# EAGLE design board (EAGLE 9.6.2)
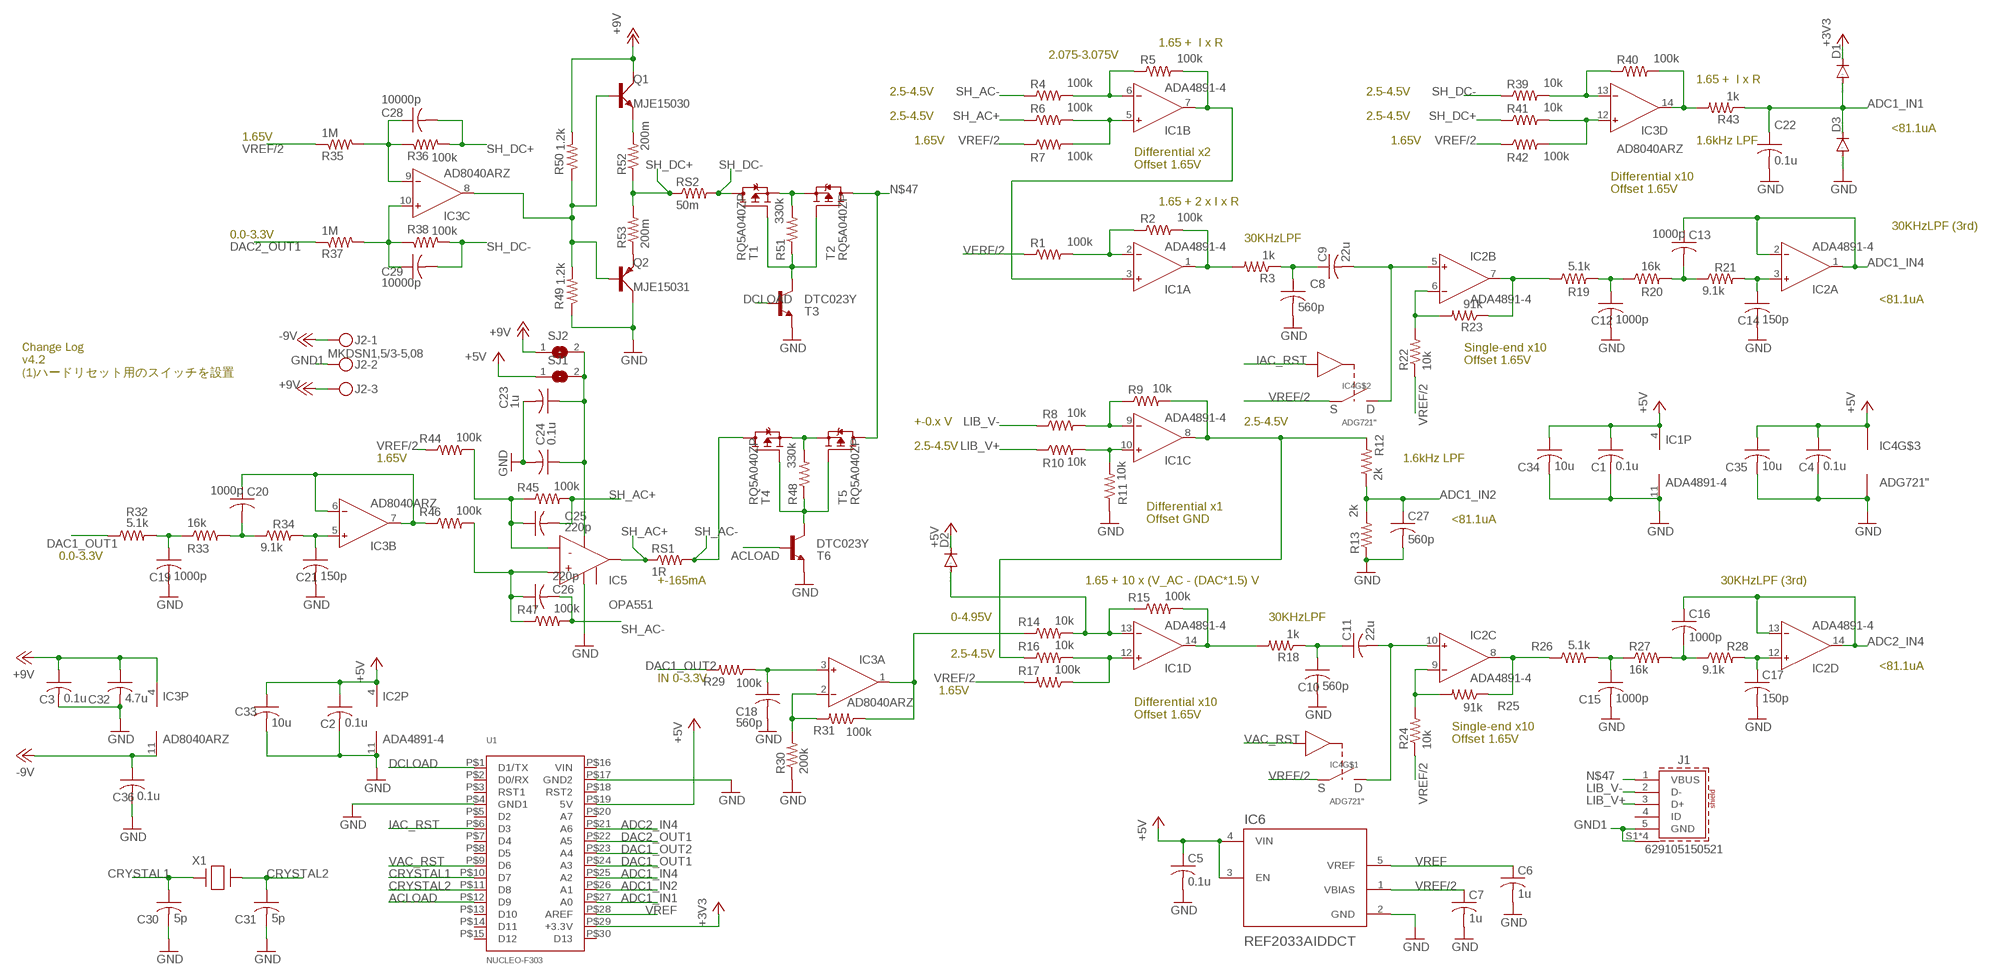
[diagram p0: schematic, sheet 1]

## Parts
C1  0.1u  C-USC0402K  [C0402K]
C2  0.1u  C-USC0402K  [C0402K]
C3  0.1u  C-USC0402K  [C0402K]
C4  0.1u  C-USC0402K  [C0402K]
C5  0.1u  C-USC0402K  [C0402K]
C6  1u  C-USC0402K  [C0402K]
C7  1u  C-USC0402K  [C0402K]
C8  560p  C-USC0402K  [C0402K]
C9  22u  C-USC0805  [C0805]
C10  560p  C-USC0402K  [C0402K]
C11  22u  C-USC0805  [C0805]
C12  1000p  C-USC0402K  [C0402K]
C13  1000p  C-USC0402K  [C0402K]
C14  150p  C-USC0402K  [C0402K]
C15  1000p  C-USC0402K  [C0402K]
C16  1000p  C-USC0402K  [C0402K]
C17  150p  C-USC0402K  [C0402K]
C18  560p  C-USC0402K  [C0402K]
C19  1000p  C-USC0402K  [C0402K]
C20  1000p  C-USC0402K  [C0402K]
C21  150p  C-USC0402K  [C0402K]
C22  0.1u  C-USC0402K  [C0402K]
C23  1u  C-USC0402K  [C0402K]
C24  0.1u  C-USC0402K  [C0402K]
C25  220p  C-USC0402K  [C0402K]
C26  220p  C-USC0402K  [C0402K]
C27  560p  C-USC0402K  [C0402K]
C28  10000p  C-USC0402K  [C0402K]
C29  10000p  C-USC0402K  [C0402K]
C30  5p  C-USC0402K  [C0402K]
C31  5p  C-USC0402K  [C0402K]
C32  4.7u  C-USC0402K  [C0402K]
C33  10u  C-USC0402K  [C0402K]
C34  10u  C-USC0402K  [C0402K]
C35  10u  C-USC0402K  [C0402K]
C36  0.1u  C-USC0402K  [C0402K]
D1  DIODE-SOD123  [SOD123]
D2  DIODE-SOD123  [SOD123]
D3  DIODE-SOD123  [SOD123]
IC1  ADA4891-4  AD8609R  [SO14]
IC2  ADA4891-4  AD8609R  [SO14]
IC3  AD8040ARZ  AD8609R  [SO14]
IC4  ADG721"  [MSOP8]
IC5  OPA551  [TO127P1435X464-8N]
IC6  REF2033AIDDCT  [SOT95P280X110-5N]
J1  629105150521  [629105150521]
J2  MKDSN1,5/3-5,08  [MKDSN1,5/3-5,08]
Q1  MJE15030  TIP41C  [TO220AV]
Q2  MJE15031  TIP42C  [TO220AV]
R1  100k  R-US_R0402  [R0402]
R2  100k  R-US_R0402  [R0402]
R3  1k  R-US_R0402  [R0402]
R4  100k  R-US_R0402  [R0402]
R5  100k  R-US_R0402  [R0402]
R6  100k  R-US_R0402  [R0402]
R7  100k  R-US_R0402  [R0402]
R8  10k  R-US_R0402  [R0402]
R9  10k  R-US_R0402  [R0402]
R10  10k  R-US_R0402  [R0402]
R11  10k  R-US_R0402  [R0402]
R12  2k  R-US_R0402  [R0402]
R13  2k  R-US_R0402  [R0402]
R14  10k  R-US_R0402  [R0402]
R15  100k  R-US_R0402  [R0402]
R16  10k  R-US_R0402  [R0402]
R17  100k  R-US_R0402  [R0402]
R18  1k  R-US_R0402  [R0402]
R19  5.1k  R-US_R0402  [R0402]
R20  16k  R-US_R0402  [R0402]
R21  9.1k  R-US_R0402  [R0402]
R22  10k  R-US_R0402  [R0402]
R23  91k  R-US_R0402  [R0402]
R24  10k  R-US_R0402  [R0402]
R25  91k  R-US_R0402  [R0402]
R26  5.1k  R-US_R0402  [R0402]
R27  16k  R-US_R0402  [R0402]
R28  9.1k  R-US_R0402  [R0402]
R29  100k  R-US_R0402  [R0402]
R30  200k  R-US_R0402  [R0402]
R31  100k  R-US_R0402  [R0402]
R32  5.1k  R-US_R0402  [R0402]
R33  16k  R-US_R0402  [R0402]
R34  9.1k  R-US_R0402  [R0402]
R35  1M  R-US_R0402  [R0402]
R36  100k  R-US_R0402  [R0402]
R37  1M  R-US_R0402  [R0402]
R38  100k  R-US_R0402  [R0402]
R39  10k  R-US_R0402  [R0402]
R40  100k  R-US_R0402  [R0402]
R41  10k  R-US_R0402  [R0402]
R42  100k  R-US_R0402  [R0402]
R43  1k  R-US_R0402  [R0402]
R44  100k  R-US_R0402  [R0402]
R45  100k  R-US_R0402  [R0402]
R46  100k  R-US_R0402  [R0402]
R47  100k  R-US_R0402  [R0402]
R48  330k  R-US_R0402  [R0402]
R49  1.2k  R-US_R0402  [R0402]
R50  1.2k  R-US_R0402  [R0402]
R51  330k  R-US_R0402  [R0402]
R52  200m  R-US_R2512  [R2512]
R53  200m  R-US_R2512  [R2512]
RS1  1R  R-US_R2512  [R2512]
RS2  50m  R-US_R2512  [R2512]
SJ1  SJ  [SJ]
SJ2  SJ  [SJ]
T1  RQ5A040ZP  [SOT23]
T2  RQ5A040ZP  [SOT23]
T3  DTC023Y  [SOT40P120X55-3N]
T4  RQ5A040ZP  [SOT23]
T5  RQ5A040ZP  [SOT23]
T6  DTC023Y  [SOT40P120X55-3N]
U1  NUCLEO-F303  [NUCLEO-F303]
X1  NX3225GD-8MHZ-STD-CRA-3XTAL_NX3225GD-8MHZ-STD-CRA-3_N  [XTAL_NX3225GD-8MHZ-STD-CRA-3_N]

## Nets
+3V3: D1.C U1.P$29(+3.3V)
+5V: C1.1 C2.1 C4.1 C5.1 C33.1 C34.1 C35.1 D2.C IC1.4(P:V+) IC2.4(P:V+) IC4.8(VDD) IC6.3(EN) IC6.4(VIN) SJ1.1 U1.P$19(5V)
+9V: J2.3 Q1.C R50.2 SJ2.1 ; supply symbol labelled -9V
-9V: C36.1 IC3.11(P:V-) J2.1 ; supply symbol labelled +9V
ACLOAD: T6.1(B) U1.P$12(D9)
ADC1_IN1: C22.1 D1.A D3.C R43.1 U1.P$27(A0)
ADC1_IN2: C27.1 R12.1 R13.2 U1.P$26(A1)
ADC1_IN3: IC3.1(A:OUT) R14.1 R31.1
ADC1_IN4: C13.1 IC2.1(A:OUT) IC2.2(A:IN-) U1.P$25(A2)
ADC2_IN4: C16.1 IC2.13(D:IN-) IC2.14(D:OUT) U1.P$21(A6)
CRYSTAL1: C30.1 U1.P$10(D7) X1.2
CRYSTAL2: C31.1 U1.P$11(D8) X1.1
DAC1_OUT1: R32.1 U1.P$24(A3)
DAC1_OUT2: R29.2 U1.P$23(A4)
DAC2_OUT1: R37.1 U1.P$22(A5)
DCLOAD: T3.1(B) U1.P$1(D1/TX)
GND1: C1.2 C2.2 C3.2 C4.2 C5.2 C6.2 C7.2 C8.2 C10.2 C12.2 C14.2 C15.2 C17.2 C18.2 C19.2 C21.2 C22.2 C23.2 C24.2 C27.2 C30.2 C31.2 C32.2 C33.2 C34.2 C35.2 C36.2 D3.A IC1.11(P:V-) IC2.11(P:V-) IC4.4(GND) IC5.4(V-) IC5.8(V-) IC6.2(GND) J1.5(GND) J1.S1(SHIELD) J1.S2(SHIELD) J1.S3(SHIELD) J1.S4(SHIELD) J2.2 Q2.C R11.1 R13.1 R30.1 R49.1 T3.2(E) T6.2(E) U1.P$4(GND1) U1.P$17(GND2) ; supply symbol labelled GND
IAC_RST: IC4.3(IN) U1.P$6(D3)
LIB_V+: J1.3(D+) R10.1
LIB_V-: J1.2(D-) R8.1
N$1: IC3.8(C:OUT) Q1.B Q2.B R49.2 R50.1
N$2: C16.2 R27.2 R28.1
N$3: IC1.9(C:IN-) R8.2 R9.1
N$4: C9.2 IC2.5(B:IN+) IC4.6(D)
N$5: IC1.14(D:OUT) R15.2 R18.2
N$6: C17.1 IC2.12(D:IN+) R28.2
N$7: C15.1 R26.2 R27.1
N$8: IC2.8(C:OUT) R25.1 R26.1
N$9: IC2.9(C:IN-) R24.2 R25.2
N$10: C11.2 IC2.10(C:IN+) IC4.2(D)
N$11: IC1.12(D:IN+) R16.2 R17.1
N$12: D2.A IC1.13(D:IN-) R14.2 R15.1
N$13: IC3.13(D:IN-) R39.2 R40.1
N$14: IC3.12(D:IN+) R41.2 R42.2
N$15: IC1.10(C:IN+) R10.2 R11.2
N$16: IC1.6(B:IN-) R4.2 R5.1
N$17: IC1.5(B:IN+) R6.2 R7.2
N$18: C13.2 R20.2 R21.1
N$19: IC3.2(A:IN-) R30.2 R31.2
N$20: C14.1 IC2.3(A:IN+) R21.2
N$21: C12.1 R19.2 R20.1
N$22: IC2.6(B:IN-) R22.2 R23.2
N$23: IC2.7(B:OUT) R19.1 R23.1
N$24: Q2.E R53.1
N$25: IC1.3(A:IN+) IC1.7(B:OUT) R5.2
N$26: R51.2 T1.2(S) T2.2(S)
N$27: IC3.14(D:OUT) R40.2 R43.2
N$28: C26.1 IC5.1(+IN) R46.2 R47.1
N$29: C18.1 IC3.3(A:IN+) R29.1
N$30: C20.2 R33.2 R34.1
N$31: C20.1 IC3.6(B:IN-) IC3.7(B:OUT) R46.1
N$32: C21.1 IC3.5(B:IN+) R34.2
N$33: C19.1 R32.2 R33.1
N$34: R51.1 T1.1(G) T2.1(G) T3.3(C)
N$35: IC1.2(A:IN-) R1.2 R2.1
N$36: C3.1 C23.1 C24.1 C32.1 IC3.4(P:V+) IC5.5(V+) SJ1.2 SJ2.2 ; supply symbol labelled +9V
N$39: C29.1 IC3.10(C:IN+) R37.2 R38.1
N$40: C28.1 IC3.9(C:IN-) R35.2 R36.1
N$41: Q1.E R52.2
N$42: R48.2 T4.2(S) T5.2(S)
N$43: IC1.1(A:OUT) R2.2 R3.2
N$44: C8.1 C9.1 R3.1
N$45: C10.1 C11.1 R18.1
N$46: R48.1 T4.1(G) T5.1(G) T6.3(C)
N$47: J1.1(VBUS) T2.3(D) T5.3(D)
N$49: IC1.8(C:OUT) R9.2 R12.2 R16.1
N$60: C25.1 IC5.2(-IN) R44.2 R45.1
SH_AC+: C25.2 IC5.6(OUT) R6.1 R45.2 RS1.1
SH_AC-: C26.2 R4.1 R47.2 RS1.2 T4.3(D)
SH_DC+: C28.2 R36.2 R41.1 R52.1 R53.2 RS2.1
SH_DC-: C29.2 R38.2 R39.1 RS2.2 T1.3(D)
VAC_RST: IC4.7(IN) U1.P$9(D6)
VERF/2: R1.1
VREF: C6.1 IC6.5(VREF) U1.P$28(AREF)
VREF/2: C7.1 IC4.1(S) IC4.5(S) IC6.1(VBIAS) R7.1 R17.2 R22.1 R24.1 R35.1 R42.1 R44.1
Unconnected: IC5.7(FLAG) J1.4(ID) U1.P$2(D0/RX) U1.P$3(RST1) U1.P$5(D2) U1.P$7(D4) U1.P$8(D5) U1.P$13(D10) U1.P$14(D11) U1.P$15(D12) U1.P$18(RST2) U1.P$20(A7) U1.P$30(D13)

## Notes on the sheet
- 1.65 +  I x R
- 2.075-3.075V
- 1.65 +  I x R
- 2.5-4.5V | 2.5-4.5V
- 2.5-4.5V | 2.5-4.5V
- 1.65V | <81.1uA
- 1.65V | 1.65V | 1.6kHz LPF
- Differential x2
  Offset 1.65V
- Differential x10
  Offset 1.65V
- 1.65 + 2 x I x R
- 0.0-3.3V | 30KHzLPF (3rd)
- 30KHzLPF
- <81.1uA
- Single-end x10
  Offset 1.65V
- Change Log
  v4.2
  (1)ハードリセット用のスイッチを設置
- +-0.x V | 2.5-4.5V
- 2.5-4.5V
- 1.65V | 1.6kHz LPF
- Differential x1
  Offset GND
- <81.1uA
- 0.0-3.3V
- +-165mA | 1.65 + 10 x (V_AC - (DAC*1.5) V | 30KHzLPF (3rd)
- 0-4.95V | 30KHzLPF
- 2.5-4.5V
- <81.1uA
- IN 0-3.3V
- 1.65V
- Differential x10
  Offset 1.65V
- Single-end x10
  Offset 1.65V

## Power pins joined to a net without a drawn wire
VIN: U1.P$16(VIN)

## Library data of the parts
C1-C5 C22 C24 C30-C36 = rcl:C-US: CAPACITOR, American symbol; #: GRM155B31C104K; SPICEPREFIX: C
C6-C21 C23 C25-C29 = rcl:C-US: CAPACITOR, American symbol; SPICEPREFIX: C
D1-D3 = diode:DIODE-: DIODE
IC1-IC3 = analog-devices:AD8609: Precision Micropower, Low Noise CMOS, Rail-to-Rail Input/Output Operational Amplifiers Source: http://www.analog.com/static/imported-files/data_sheets/AD8603_8607_8609.pdf; MPN: AD8609ARZ; OC_FARNELL: 1581951; OC_NEWARK: 19M0976
IC4 = ADG721:ADG721
IC5 = OPA551:OPA551
IC6 = REF2033AIDDCT:REF2033AIDDCT: 3.3-V Vref, low-drift, low-power, dual-output Vref & Vref/2 voltage reference 5-SOT-23-THIN -40 to 125 Check prices <https://pricing.snapeda.com/parts/REF2033AIDDCT/Texas%20Instruments/view-part?ref=eda>; AVAILABILITY: In Stock; DESCRIPTION: 3.3-V Vref, low-drift, low-power, dual-output Vref & Vref/2 voltage reference 5-SOT-23-THIN -40 to 125; MF: Texas Instruments; MP: REF2033AIDDCT; PACKAGE: SOT-23-THN-5 Texas Instruments; PRICE: None; PURCHASE-URL: https://pricing.snapeda.com/search/part/REF2033AIDDCT/?ref=eda
J1 = Wurth_Connectors_WR-USB-DrillSize-Modified:629105150521: WR-COM Micro USB 2.0 SMT Type B Horizontal 5 Contacts High Current Kind Properties Durability:10 000 Mating cycles Quality Class:10 000 Mating cycles Connector Type:Micro USB Gender:Receptacle Type:Horizontal General Information Operating Temperature:-40up to +105 °C Compliance:RoHS Electrical Properties IR 1:3A Working Voltage:30V (AC) Withstanding Voltage:100V (AC) Contact Resistance:30 mΩ Material Properties Insulator Material:LCP Insulator Flammability Rating:UL94 V-0 Color:Black Contact Material:Copper Alloy Contact Plating: Gold Contact Type:Stamped Shielding Material:Stainless Steel Shielding Plating:Nickel <https://www.we-online.com/catalog/media/o86333v209%20WR-COM_629105150521_family.jpg> Details see: www.we-online.com/en/components/products/COM_MICRO_SMT_TYPE_B_HORIZONTAL_HIGH_CURRENT <www.we-online.com/catalog/COM_MICRO_SMT_TYPE_B_HORIZONTAL_HIGH_CURRENT/?utm_source=eagle_model&utm_medium=description_link&utm_campaign=eisos_eagle> Updated by Ella Wu 2023-05-30 2023 (C) Würth Elektronik; APPLICATION: Micro USB 2.0; DATASHEET-URL: https://www.we-online.com/redexpert/spec/629105150521?ae; GERDER: Receptacle; INTERFACE-TYPE: Type B; IR: 3.0A; MOUNT: SMT; PACKAGING: Tape and Reel; PART-NUMBER: 629105150521; PINS: 5; TYPE: Horizontal; WORKING-VOLTAGE: 30V(AC)
J2 = con-phoenix-508:MKDSN1,5/3-5,08: MKDSN 1,5/ 3-5,08 Printklemme Nennstrom: 13,5 A Nennspannung: 250 V Rastermaß: 5,08 mm Polzahl: 3 Anschlussart: Schraubanschluss Montage: Löten Anschlussrichtung Leiter/Platine: 0 ° Artikelnummer: 1729131 Source: http://eshop.phoenixcontact.com .. 1729131.pdf
Q1 = transistor-power:TIP41C: NPN TRANSISTOR
Q2 = transistor-power:TIP42C: PNP TRANSISTOR
R1-R53 RS1 RS2 = rcl:R-US_: RESISTOR, American symbol; SPICEPREFIX: R
SJ1 SJ2 = jumper:SJ: SMD solder JUMPER
T1 T2 T4 T5 = RQ5A040ZP:RQ5A040ZP
T3 T6 = DTC023Y:DTC023Y
U1 = nucleo-F303:NUCLEO-F303
X1 = NX3255GD:NX3225GD-8MHZ-STD-CRA-3; COPYRIGHT: Copyright (C) 2022 Ultra Librarian. All rights reserved.; MANUFACTURER_PART_NUMBER: NX3225GD-8MHZ-STD-CRA-3; MFR_NAME: NDK

## Board
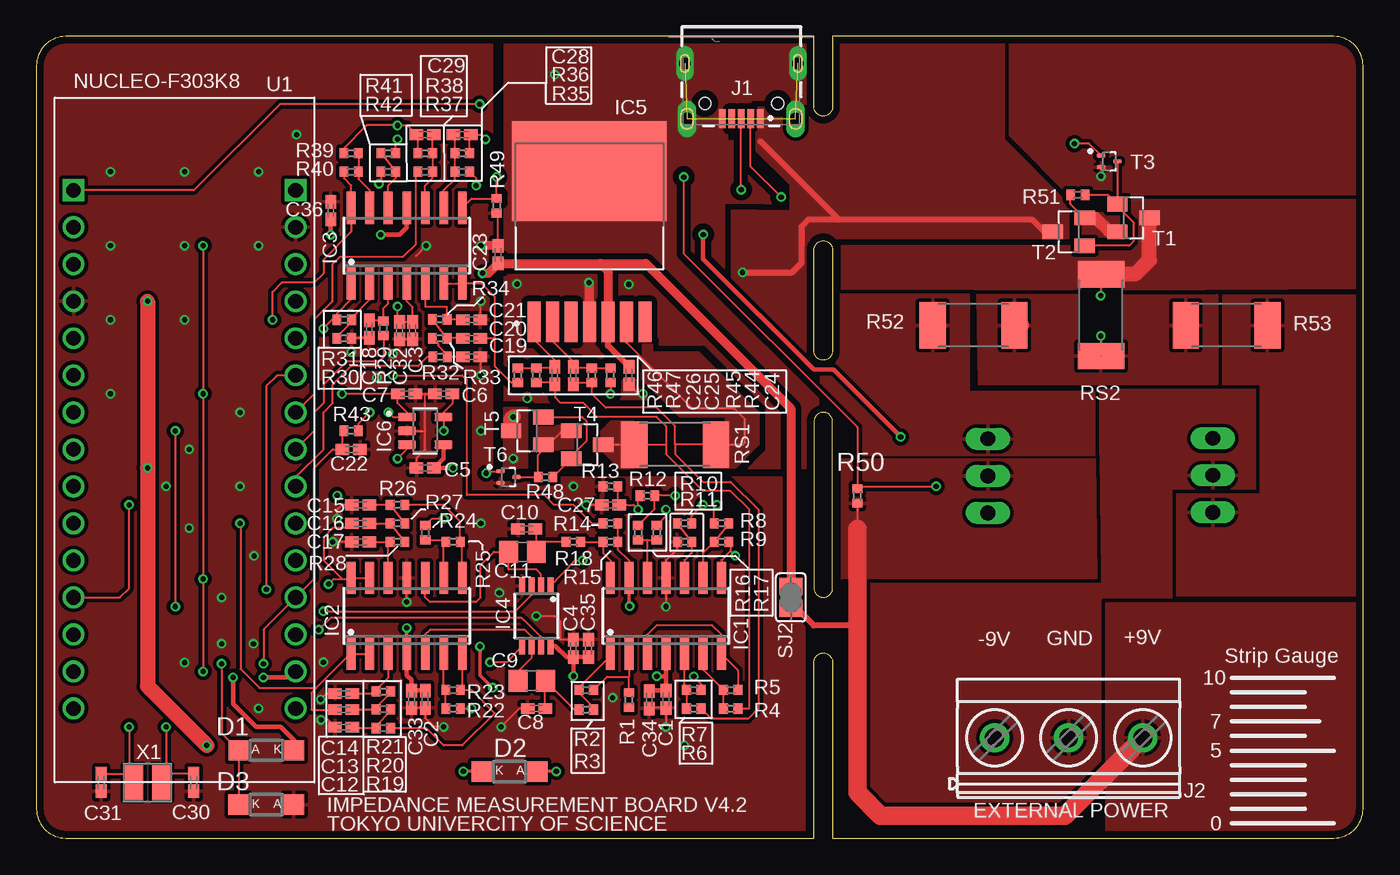
[diagram p1: board, top side]
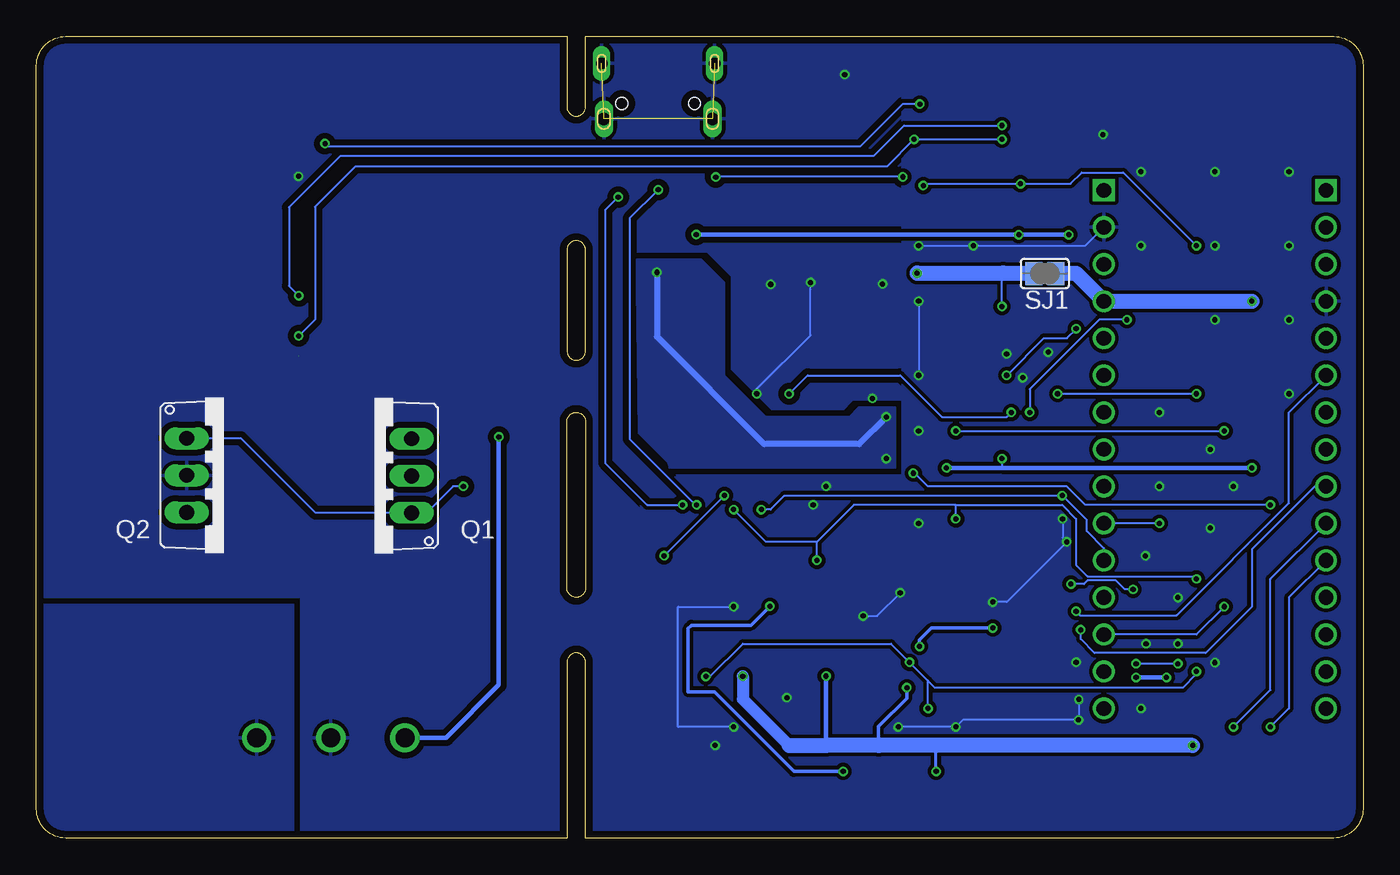
[diagram p2: board, bottom side, seen from below]

Size 91 x 55 mm. Coordinates in mm from the lower left corner, seen from the top.
Outline: 0,53 0,2 arc90 2,0 53.34,0 53.34,12.06 arc-90 53.98,12.7 arc-90 54.61,12.06 54.61,0 89,0 arc90 91,2 91,53 arc90 89,55 54.61,55 54.61,50.16 arc-90 53.98,49.53 arc-90 53.34,50.16 53.34,55 2,55 arc90 0,53
Outline: 53.98,16.51 arc90 54.61,17.14 54.61,28.57 arc90 53.98,29.21 arc90 53.34,28.57 53.34,17.14 arc90 53.98,16.51
Outline: 54.61,40.35 54.61,33.42 arc-90 53.94,32.78 arc-90 53.34,33.42 53.34,40.35 arc-90 53.94,40.98 arc-90 54.61,40.35
Copper layers (1*16): Top 0.035mm / dielectric 1.53mm / Bottom 0.035mm
Design rules "pban_5mil-l2": minimum track width 5mil, minimum drill 0.3mm, track to track 5mil, track to pad 0.229mm, pad to pad 5mil, via to via 5mil, smd to smd 5mil, copper to edge 0.5mm, drill to drill 0.5mm, minimum pad ring 0.15mm, minimum via ring 0.15mm, stop-mask expansion 4mil, vias tented up to drill 0.35mm, thermal gap 10mil

### Footprints (pad centres in the part's own frame; a part is rotated, then mirrored left to right if it is on the bottom)
C0402K = smd 0.925 x 0.74: 1 -0.6,0; 2 0.6,0
C0805 = smd 1.3 x 1.5: 1 -0.95,0; 2 0.95,0
SOD123 = smd 1.4 x 1.4: A 1.9,0; C -1.9,0
SO14 = smd 0.6 x 2.2: 1 -3.81,-2.6; 2 -2.54,-2.6; 3 -1.27,-2.6; 4 0,-2.6; 5 1.27,-2.6; 6 2.54,-2.6; 7 3.81,-2.6; 8 3.81,2.6; 9 2.54,2.6; 10 1.27,2.6; 11 0,2.6; 12 -1.27,2.6; 13 -2.54,2.6; 14 -3.81,2.6
MSOP8 = smd 0.4 x 1.2: 1 -0.975,-2.05; 2 -0.325,-2.05; 3 0.325,-2.05; 4 0.975,-2.05; 5 0.975,2.05; 6 0.325,2.05; 7 -0.325,2.05; 8 -0.975,2.05
TO127P1435X464-8N = smd 0.89 x 2.79: 1 -3.81,-6.19; 2 -2.54,-6.19; 3 -1.27,-6.19; 4 0,-6.19; 5 1.27,-6.19; 6 2.54,-6.19; 7 3.81,-6.19 | smd 10.58 x 6.84: 8 0,4.16
SOT95P280X110-5N = smd 1.25 x 0.59: 1 -1.255,0.95; 2 -1.255,0; 3 -1.255,-0.95; 4 1.255,-0.95; 5 1.255,0.95
629105150521 = smd 0.45 x 1.3: 1 -1.3,2.9; 2 -0.65,2.9; 3 0,2.9; 4 0.65,2.9; 5 1.3,2.9 | drill 0.85 pad 1 long: S1 -3.725,2.9; S2 3.725,2.9 | drill 0.8 pad 0.9 long: S3 3.875,-0.9; S4 -3.875,-0.9 | hole 0.8: -2.5,1.85; 2.5,1.85
MKDSN1,5/3-5,08 = drill 1.3 pad 2: 1 -7.641,0.025; 2 -2.561,0.025; 3 2.519,0.025
TO220AV = drill 1.016 long: B -2.54,-2.54; C 0,-2.54; E 2.54,-2.54
R0402 = smd 0.6 x 0.7: 1 -0.5,0; 2 0.5,0
R2512 = smd 1.8 x 3.2: 1 -2.8,0; 2 2.8,0
SJ = smd 1.168 x 1.6: 1 -0.762,0; 2 0.762,0
SOT23 = smd 1 x 1.4: 1 -0.95,-1.1; 2 0.95,-1.1; 3 0,1.1
SOT40P120X55-3N = smd 0.59 x 0.25: 1 -0.555,0.4; 2 -0.555,-0.4; 3 0.555,0
NUCLEO-F303 = drill 1 square: P$1 -7.62,17.78; P$16 7.62,17.78 | drill 1: P$2 -7.62,15.24; P$3 -7.62,12.7; P$4 -7.62,10.16; P$5 -7.62,7.62; P$6 -7.62,5.08; P$7 -7.62,2.54; P$8 -7.62,0; P$9 -7.62,-2.54; P$10 -7.62,-5.08; P$11 -7.62,-7.62; P$12 -7.62,-10.16; P$13 -7.62,-12.7; P$14 -7.62,-15.24; P$15 -7.62,-17.78; P$17 7.62,15.24; P$18 7.62,12.7; P$19 7.62,10.16; P$20 7.62,7.62; P$21 7.62,5.08; P$22 7.62,2.54; P$23 7.62,0; P$24 7.62,-2.54; P$25 7.62,-5.08; P$26 7.62,-7.62; P$27 7.62,-10.16; P$28 7.62,-12.7; P$29 7.62,-15.24; P$30 7.62,-17.78
XTAL_NX3225GD-8MHZ-STD-CRA-3_N = smd 1.295 x 2.388: 1 -0.953,0; 2 0.953,0

### Placement (x,y rotation side)
C1  43.18,9.53 270 top
C2  26.67,9.53 270 top
C3  25.81,34.82 270 top
C4  36.83,13.02 90 top
C5  26.67,25.4 180 top
C6  27.94,30.48 180 top
C7  25.4,30.48 0 top
C8  34.29,8.89 180 top
C9  33.97,10.79 180 top
C10  33.63,21.21 180 top
C11  33.34,19.64 180 top
C12  21.08,7.62 180 top
C13  21.08,8.81 0 top
C14  21.08,9.91 180 top
C15  22.23,22.86 180 top
C16  22.23,21.59 0 top
C17  22.23,20.32 180 top
C18  22.83,34.92 270 top
C19  29.84,33.02 0 top
C20  29.84,34.29 180 top
C21  29.84,35.56 0 top
C22  21.59,26.67 0 top
C23  31.67,40.03 90 top
C24  40.64,31.75 270 top
C25  36.83,31.75 270 top
C26  35.56,31.75 270 top
C27  39.37,22.86 180 top
C28  29.21,48.26 0 top
C29  26.67,48.26 180 top
C30  10.79,3.81 270 top
C31  4.45,3.81 270 top
C32  24.92,34.82 270 top
C33  25.73,9.53 270 top
C34  42.04,9.5 270 top
C35  37.87,13.03 90 top
C36  20.19,43.05 90 top
D1  15.77,6.02 180 top
D2  32.46,4.57 0 top
D3  15.75,2.29 0 top
IC1  43.18,15.24 0 top
IC2  25.4,15.24 0 top
IC3  25.4,40.64 0 top
IC4  34.29,15.24 180 top
IC5  37.93,41.6 0 top
IC6  26.67,27.94 0 top
J1  48.35,52.25 180 top
J2  73.37,6.86 0 top
Q1  67.8,24.85 90 bottom
Q2  78.15,24.89 270 bottom
R1  40.64,9.47 90 top
R2  37.72,10.16 180 top
R3  37.72,8.81 0 top
R4  47.62,8.89 180 top
R5  47.62,10.16 0 top
R6  45.09,8.89 180 top
R7  45.09,10.16 180 top
R8  46.99,21.59 0 top
R9  46.99,20.32 0 top
R10  44.45,21.59 180 top
R11  44.45,20.32 0 top
R12  41.91,23.5 0 top
R13  39.37,24.13 0 top
R14  39.37,21.59 0 top
R15  39.37,20.32 180 top
R16  41.27,20.95 270 top
R17  42.55,20.95 90 top
R18  36.83,20.32 0 top
R19  23.8,7.54 180 top
R20  23.8,8.84 180 top
R21  23.8,10.06 180 top
R22  28.57,8.89 180 top
R23  28.57,10.16 180 top
R24  26.67,20.95 270 top
R25  28.57,20.32 180 top
R26  24.77,22.86 180 top
R27  24.77,21.59 180 top
R28  24.77,20.32 180 top
R29  23.8,34.98 270 top
R30  21.11,34.29 180 top
R31  21.11,35.56 0 top
R32  27.69,33.02 0 top
R33  27.66,34.29 0 top
R34  27.66,35.59 0 top
R35  29.21,45.72 180 top
R36  29.21,46.99 0 top
R37  26.67,45.72 0 top
R38  26.67,46.99 180 top
R39  21.59,46.99 0 top
R40  21.59,45.72 180 top
R41  24.13,46.99 180 top
R42  24.13,45.72 0 top
R43  21.59,27.94 0 top
R44  39.37,31.75 90 top
R45  38.1,31.75 270 top
R46  33.02,31.75 90 top
R47  34.29,31.75 270 top
R48  34.92,24.77 0 top
R49  31.57,43.38 90 top
R50  56.31,23.47 270 top
R51  71.44,44.13 180 top
R52  64.28,35.18 180 top
R53  81.64,35.18 180 top
RS1  43.81,26.99 180 top
RS2  73.03,35.88 90 top
SJ1  21.83,38.73 180 bottom
SJ2  51.75,16.51 90 top
T1  75.25,42.55 270 top
T2  70.8,41.59 90 top
T3  73.59,46.42 0 top
T4  37.78,26.99 270 top
T5  33.66,27.94 90 top
T6  32.38,24.77 0 top
U1  10.16,26.67 0 top
X1  7.62,3.81 0 top

### Tracks (layer width: path | path; a pad name or v marks a point on that pad's centre or on a via)
+3V3  (via drill 0.35)
  Top 0.305: U1.P$29 17.37,11.02 v15.57,11.02 | v13.49,11.02 13.49,10.88 13.49,9.22 15.09,7.62 16.76,7.62 17.67,6.71 D1.C
  Bottom 0.305: v13.49,11.02 v15.57,11.02
+5V  (via drill 0.35)
  Top 0.152: IC6.3 25.41,26.68 v24.77,26.04
  Top 0.203: D2.C v29.29,4.57
  Top 0.254: v30.42,13.14 30.43,13.13 30.43,11.16 31.28,10.31 v31.3,10.31 | v25.4,14.41 IC2.4
  Top 0.305: IC1.4 43.18,11.1 | 43.18,11.1 C1.1 42.06,10.12 C34.1 | v42.55,11.1 43.18,11.1 | v28.57,25.4 C5.1 27.93,26.05 IC6.4 | IC4.8 35.58,13.19 36.39,12.38 36.8,12.38 C4.1 | C4.1 v36.83,11.11 | C4.1 36.84,12.43 C35.1 | IC2.4 25.4,11.18 25.73,10.85 C33.1 C2.1
  Top 1.016: v11.68,6.35 7.62,10.41 v7.62,25.4 v7.62,36.83
  Bottom 0.152: v24.77,26.04 24.77,25.4
  Bottom 0.203: v29.29,4.57 29.29,6.33 29.31,6.35
  Bottom 0.254: 33.24,6.35 33.24,7.66 31.3,9.6 v31.3,10.31 | v25.4,14.41 29.6,14.41 30.42,13.59 v30.42,13.14
  Bottom 0.305: v7.62,25.4 24.77,25.4 v28.57,25.4 | v36.83,11.11 36.83,6.35
  Bottom 0.813: v42.55,11.1 42.55,9.53 39.37,6.35
  Bottom 1.016: v7.62,36.83 U1.P$19 19.68,38.73 SJ1.1 | v11.68,6.35 29.31,6.35 33.24,6.35 36.83,6.35 39.37,6.35
+9V
  Top 0.152: R50.2 56.31,21.94 | 56.31,21.94 | 56.31,21.94 56.31,21.21
  Top 0.305: R50.2 56.31,22.8
  Top 0.406: 56.31,14.58 53.33,14.58 52.16,15.75 SJ2.1
  Top 1.27: J2.3 70.54,1.54 57.89,1.54 56.31,3.13 56.31,14.58 56.31,21.21
  pour Top (isolate 0.254): 73.41,-0.64 73.41,16.13 91.76,16.13 91.76,-0.64
  pour Bottom (isolate 0.254): 73.34,-0.64 73.34,16 91.44,16 91.44,-0.64
  pour Top (isolate 0.254): 55.24,26 72.61,26 72.7,17.8 55.26,17.8 55.24,17.78
-9V  (via drill 0.35)
  Top 0.305: v20.19,41.4 C36.1 | v23.62,41.4 v23.63,41.4 24.92,41.4 25.4,41.87 IC3.11 | v59.29,27.52 54.67,32.13 53.32,32.13 45.74,39.72 v45.74,41.41
  Bottom 0.305: J2.1 62.91,6.88 59.29,10.5 v59.29,27.52 | v20.19,41.4 v23.62,41.4 23.64,41.42 v45.73,41.42 v45.74,41.41
ACLOAD  (via drill 0.35)
  Top 0.152: U1.P$12 5.71,16.51 6.35,17.14 v6.35,22.86 | v30.85,25.03 30.99,25.16 T6.1
  Bottom 0.152: v6.35,22.86 19.05,22.86 20.32,24.13 29.84,24.13 30.74,25.03 v30.85,25.03
ADC1_IN1  (via drill 0.35)
  Top 0.152: R43.1 20.99,27.84 C22.1 20.32,26.67 19.05,25.4 19.05,17.78 U1.P$27 15.57,14.3 v15.57,11.96 | v12.7,11.96 12.7,7.19 D1.A 13.87,2.31 D3.C
  Bottom 0.152: v12.7,11.96 v15.57,11.96
ADC1_IN2  (via drill 0.35)
  Top 0.152: R12.1 41.27,23.5 v41.27,22.54 40.96,22.86 C27.1 39.87,23.03 R13.2
  Bottom 0.152: v41.27,22.54 40.64,22.54 39.69,23.5 v20.64,23.5 18.96,21.82 18.96,21.06 17.78,19.88 U1.P$26
ADC1_IN3  (via drill 0.35)
  Top 0.152: IC3.1 21.59,36.97 20.61,35.99 R31.1 20.29,35.56 v19.68,34.95 | R14.1 38.1,21.59 36.83,22.86 35.52,22.86 34.84,23.54 29.53,23.54 29.53,31.43 29.21,31.75 v24.45,31.75
  Bottom 0.152: v24.45,31.75 21.9,34.29 20.32,34.29 19.68,34.93 v19.68,34.95
ADC1_IN4  (via drill 0.35)
  Top 0.152: C13.1 18.86,8.81 18.86,9.97 19.19,10.3 | IC2.2 IC2.1 21.56,12.67 19.19,10.3 | v13.97,21.59 13.99,21.57 13.99,11.61 15.3,10.3 19.19,10.3
  Bottom 0.152: v13.97,21.59 U1.P$25
ADC2_IN4  (via drill 0.35)
  Top 0.152: 20.95,17.78 19.68,19.05 19.68,20.64 20.32,21.27 21.31,21.27 C16.1 | 20.95,17.78 21.53,17.78 IC2.14 IC2.13 | U1.P$21 16.51,31.75 15.77,31.01 v15.77,17.06 | v20.04,17.42 20.4,17.78 20.95,17.78
  Bottom 0.152: v15.77,17.06 16.35,17.06 16.95,17.66 18.9,17.66 19.14,17.42 v20.04,17.42
CRYSTAL1  (via drill 0.35)
  Top 0.152: C30.1 9.17,4.41 X1.2 8.89,4.13 v8.89,7.62
  Bottom 0.152: v8.89,7.62 6.35,10.16 6.35,17.78 U1.P$10
CRYSTAL2  (via drill 0.35)
  Top 0.152: C31.1 6.07,4.41 X1.1 6.35,4.13 v6.35,7.62
  Bottom 0.152: v6.35,7.62 5.08,8.89 5.08,16.51 U1.P$11
DAC1_OUT1
  Top 0.152: R32.1 26.83,33.02 26.2,32.38 21.59,32.38 20.32,31.11 20.32,29.84 19.68,29.21 19.68,26.67 17.78,24.77 U1.P$24
DAC1_OUT2
  Top 0.152: U1.P$23 19.05,27.94 19.05,29.21 19.68,29.84 19.68,31.11 21.27,32.7 23.5,32.7 23.8,33.01 R29.2
DAC2_OUT1
  Top 0.152: R37.1 26.04,45.59 26.04,40.77 25.15,39.88 20.83,39.88 20.32,39.37 20.32,36.83 19.05,35.56 19.05,30.48 U1.P$22
DCLOAD  (via drill 0.35)
  Top 0.152: v30.41,50.36 v30.4,50.36 16.7,50.36 10.79,44.45 U1.P$1 | v71.21,47.65 v71.22,47.66 72.2,47.66 T3.1
  Bottom 0.152: v30.41,50.36 v30.42,50.37 31.58,50.37 34.47,47.48 71.04,47.48 v71.21,47.65
GND1  (via drill 0.35)  (4 unrouted)
  Top 0.152: R11.1 43.95,19.82 43.18,19.05 IC1.11 v43.18,15.88 | v43.18,7.62 C1.2 42.06,8.93 C34.2 | v25.4,16.19 IC2.11 | C2.2 26.67,8.26 27.3,7.62 v27.94,7.62 | C7.2 26.67,30.48 | 26.67,30.48 C6.2 | IC6.2 26.67,27.94 | 26.67,27.94 26.67,30.48 | C19.2 30.48,32.98 v30.48,31.75 | C21.2 30.48,35.59 v30.48,36.83 | C5.2 26.07,26.07 26.67,26.67 26.67,27.94 | C15.2 20.95,22.86 20.61,22.51 v20.61,21.91 | C12.2 20,8.1 v19.52,8.1 | C14.2 19.87,9.91 19.49,9.53 v19.49,9.5 | C2.2 26.7,8.89 | C24.2 41.31,30.48 v41.59,30.48 | C27.2 v37.72,22.86 | C17.2 v20.32,20.32 | v34.29,15.24 35.56,15.24 35.91,14.89 35.91,13.62 C4.2 36.84,13.63 C35.2 | v73.03,45.4 73.04,45.41 T3.2 | R30.1 21.65,34.33 C18.2 | C2.2 C33.2 | v31.88,7.62 33.15,8.89 C8.2 | R49.1 31.62,42.83 31.62,40.63 31.62,40.58 | C32.2 C3.2 | 26.04,39.94 v26.74,40.65 | T6.2
  Top 0.61: 31.62,40.63 C23.2 31.65,40.64 v30.48,40.64 | v37.9,38.12 37.9,35.44 IC5.4
  Bottom 0.152: v30.48,36.83 v30.48,31.75 | v19.49,9.5 19.49,8.13 v19.52,8.1 27.46,8.1 v27.94,7.62 v31.88,7.62 | v43.18,7.62 46.99,7.62 46.99,15.88 v43.18,15.88 | v34.29,15.24 33.34,15.24 v31.75,16.83 | v41.59,30.48 41.59,30.8 37.9,34.49 v37.9,38.12 v37.91,38.12 | v25.4,16.19 24.45,16.19 v20.32,20.32 20.61,20.61 v20.61,21.91 | v30.48,40.64 19.05,40.64 U1.P$17
  other vias: 30.48,21.59 39.52,9.63 15.24,8.89 44.45,6.35 10.16,45.72 19.68,12.06 5.08,30.48 5.08,35.56 5.08,45.72 5.08,40.64 10.16,35.56 12.7,16.51 13.97,29.21 15.24,40.64 15.24,45.72 10.16,40.64 10.48,26.67 10.16,12.04 10.48,21.27 8.89,24.13 13.97,24.13 36.83,24.13 32.96,38.01 40.63,37.99 23.34,31.59 33.66,30.16 24.45,33.22 17.85,48.26 35.56,52.39 30.48,27.94 21.59,33.34 14.92,19.37 14.88,13.34 12.7,13.34
  pour Top (isolate 0.254, rank 6): -0.45,0 52.7,0 52.7,24.75 31.27,24.75 31.27,57.15 -0.45,57.15
  pour Bottom (isolate 0.254, rank 6): -0.44,0 49.53,0 49.53,24.77 31.59,24.77 31.59,57.15 -0.44,57.15
  pour Top (isolate 0.406, rank 6, no thermals): 32.07,57.13 32.07,25.4 43.55,25.4 53.66,25.38 53.64,25.41 53.64,47.81 53.62,47.8 47.41,47.8 47.37,50.4 53.54,50.4 53.54,57.17 47.42,57.15 47.4,57.13
  pour Bottom (isolate 0.406, rank 6): -2.22,57.15 -2.22,-0.76 95.12,-0.76 95.12,56.9 61.76,57.14 61.76,57.14 52.49,57.15
  pour Top (isolate 0.254, rank 6): 93.98,57.15 93.98,-2.54 55.2,-2.54 55.2,57.15
IAC_RST  (via drill 0.35)
  Top 0.15: 32.81,15.56 32.84,15.56 33.97,16.68 IC4.3
  Top 0.152: v19.68,15.56 32.81,15.56
  Bottom 0.152: v19.68,15.56 19.42,15.29 12.78,15.29 5.08,22.99 5.08,29.21 U1.P$6
LIB_V+  (via drill 0.35)
  Top 0.15: v48.34,44.49
  Top 0.152: R10.1 44.95,22.09 v45.72,22.86 | v48.34,44.49 J1.3
  Bottom 0.15: v48.34,44.49 50.31,42.52 50.31,27.39 45.78,22.86 v45.72,22.86
LIB_V-  (via drill 0.35)
  Top 0.15: v51.09,43.98 48.99,46.07
  Top 0.152: R8.1 46.49,22.68 v46.67,22.86 | 48.99,46.07 J1.2
  Bottom 0.152: v51.09,43.98 51.98,43.08 51.98,25.74 49.11,22.86 v46.67,22.86
N$1  (via drill 0.35)
  Top 0.152: IC3.8 29.85,43.88 R49.2 v31.57,45.36 | v61.72,24.13 56.47,24.13 R50.1 56.31,28.19 44.4,40.09 v44.4,45.36
  Bottom 0.152: Q2.B 76.96,27.43 71.84,22.31 Q1.B 64.24,22.31 62.43,24.13 v61.72,24.13 | v31.57,45.36 v44.4,45.36
N$2
  Top 0.152: C16.2 R27.2 R28.1
N$3
  Top 0.152: IC1.9 45.72,19.55 R9.1 R8.2
N$4
  Top 0.152: IC2.5 26.67,13.97 26.99,14.29 33.51,14.29 33.97,13.83 IC4.6 33.97,12.38 33.02,11.43 C9.2
N$5
  Top 0.152: IC1.14 39.37,19.05 38.87,19.55 R15.2 R18.2
N$6
  Top 0.152: C17.1 R28.2 24.13,20.18 IC2.12
N$7
  Top 0.152: R27.1 R26.2 C15.1
N$8
  Top 0.152: IC2.8 29.21,20.18 R25.1 29.07,21.73 27.94,22.86 R26.1
N$9
  Top 0.152: R24.2 27.94,20.45 R25.2 27.94,20.18 IC2.9
N$10
  Top 0.152: IC2.10 26.67,16.51 26.99,16.19 30.16,16.19 30.48,16.51 30.48,18.73 31.39,19.64 C11.2 32.38,18.41 34.29,18.41 34.61,18.1 34.61,17.3 IC4.2
N$11
  Top 0.152: R16.2 41.91,20.45 | 41.91,20.45 R17.1 | IC1.12 41.91,20.45
N$12  (via drill 0.35)
  Top 0.152: 40.64,17.78 IC1.13 40.64,19.05 39.87,19.82 R15.1 R14.2
  Top 0.203: v35.66,4.57 D2.A
  Top 0.254: v40.69,15.9 40.64,15.95 40.64,17.78
  Bottom 0.254: v35.66,4.57 39.04,4.57 44.5,10.03 46.3,10.03 46.3,14.38 46.08,14.61 41.99,14.61 v40.69,15.9
N$13
  Top 0.152: R39.2 R40.1 22.09,45.22 22.86,44.45 IC3.13
N$14
  Top 0.152: IC3.12 24.13,44.77 24.63,45.27 R42.2 R41.2
N$15
  Top 0.152: IC1.10 44.45,19.05 44.95,19.55 R11.2 R10.2
N$16
  Top 0.152: IC1.6 45.72,11.56 R5.1 R4.2
N$17
  Top 0.152: R6.2 R7.2 44.41,10.16 44.41,11.77 44.45,11.77 IC1.5
N$18
  Top 0.127: R21.1 24.3,9.96 23.3,8.96 R20.2
  Top 0.152: R20.2 23.27,8.81 C13.2
N$19
  Top 0.152: IC3.2 22.86,36.93 21.61,35.69 R31.2 21.61,35.42 20.61,34.42 R30.2
N$20
  Top 0.152: IC2.3 24.13,11 23.3,10.17 R21.2 23.15,9.91 C14.1
N$21
  Top 0.152: R20.1 24.3,8.71 23.3,7.71 R19.2 21.76,7.54 C12.1
N$22
  Top 0.152: R22.2 R23.2 27.94,10.29 IC2.6
N$23
  Top 0.152: IC2.7 29.21,10.29 R23.1 29.84,10.16 31.43,8.57 29.21,6.35 27.94,6.35 26.75,7.54 R19.1
N$24
  pour Top (isolate 0.254): 78.25,23.6 83.98,23.6 83.98,31.11 81.4,31.11 81.4,37.26 91.4,37.26 91.4,16.6 78.25,16.6
N$25
  Top 0.152: R5.2 48.12,11.51 IC1.7 46.99,13.97 46.35,14.61 42.55,14.61 41.91,13.97 IC1.3
N$26
  Top 0.152: T2.2 70.94,43.51 R51.2
  Top 0.813: T2.2 72.65,42.54 73.59,41.59 T1.2
  pour Top (isolate 0.254, no thermals): 71.75,42.86 71.75,41.27 74.3,41.27 74.3,42.86
N$27  (via drill 0.35)
  Top 0.152: R43.2 22.09,28.44 v22.86,29.21 | R40.2 21.09,45.27 21.59,44.77 IC3.14 21.59,41.59 19.68,39.69 19.68,38.73 19.05,38.1 16.83,38.1 16.19,37.47 v16.19,35.56
  Bottom 0.152: v16.19,35.56 18.1,35.56 22.86,30.8 v22.86,29.21
N$28
  Top 0.152: R46.2 R47.1 35.46,32.25 C26.1 35.56,32.77 34.12,34.21 IC5.1
N$29
  Top 0.152: C18.1 23.75,35.52 R29.1 23.8,36.35 24.13,36.68 24.13,37.49 24.11,37.52 24.11,38.02 IC3.3
N$30
  Top 0.152: C20.2 R33.2 28.16,34.31 R34.1
N$31
  Top 0.15: 31.18,34.29 31.41,34.29 31.43,34.32
  Top 0.152: IC3.6 IC3.7 30.54,38.04 31.43,37.15 31.43,34.32 31.43,32.38 32.57,31.25 R46.1 | C20.1 31.18,34.29
N$32
  Top 0.152: C21.1 29.22,35.59 R34.2 28.14,35.6 28.14,36.45 26.67,36.45 IC3.5
N$33
  Top 0.152: R32.2 28.28,33.02 | 28.28,33.02 C19.1 | R33.1 27.53,33.92 27.53,33.8 28.28,33.06 28.28,33.02
N$34
  Top 0.152: T1.1 74.15,43.36 75.24,42.27 75.24,40.91 74.97,40.64 T2.1 | 74.15,45.49 T1.1 | T3.3 74.15,45.49 | 74.15,45.49 | R51.1 73.51,44.13 T1.1
N$35
  Top 0.152: R1.2 40.64,11.07 | IC1.2 40.64,11.07 | R2.1 39.13,11.07 40.64,11.07
N$36  (via drill 0.35)
  Top 0.152: IC3.4 25.4,36.83 25.81,36.42 C3.1 C32.1 24.77,35.58 v24.77,36.47
  Top 0.406: C24.1 39.2,33.79 IC5.5
  Top 0.61: v30.6,38.76 31,38.76 C23.1 38.68,39.43 | 38.68,39.43 39.2,38.9 IC5.5 | 38.68,39.43 41.8,39.43 51.74,29.48 SJ2.2
  Bottom 0.152: v24.77,36.47 24.77,38.71 24.74,38.73 24.7,38.77
  Bottom 1.016: SJ1.2 24.74,38.73 | v30.6,38.76 v30.59,38.77 24.7,38.77
N$39
  Top 0.152: IC3.10 26.67,44.77 27.17,45.27 R37.2 R38.1 27.17,48.16 C29.1
N$40
  Top 0.152: IC3.9 27.94,44.45 28.71,45.22 R35.2 R36.1 28.71,48.16 C28.1
N$41
  pour Top (isolate 0.254): 55.2,26.29 72.6,26.29 72.6,30.6 64,30.6 64,37.29 53.8,37.29 53.8,29.8 55.26,28.33
N$42
  Top 0.152: T5.2 37.43,28.89 37.72,28.6 37.72,27.23 36.68,26.19 T4.2 36.68,26.02 R48.2
N$43
  Top 0.152: IC1.1 39.44,12.57 37.22,10.35 R2.2 37.22,9.96 38.22,8.96 R3.2
N$44
  Top 0.152: R3.1 36.9,8.81 C9.1 | C9.1 | C8.1 34.89,10.76 C9.1
N$45
  Top 0.152: C10.1 34.29,21.15 34.29,20.32 | 34.29,20.32 C11.1 | R18.1 34.29,20.32
N$46
  Top 0.152: T6.3 R48.1 34.42,26.29 34.76,26.62 | T4.1 36.07,27.94 34.76,26.62 | 34.76,26.62 T5.1
  pour Top (no thermals): 34.29,28.26 34.29,26.67 36.83,26.67 36.83,28.26
N$47  (via drill 0.35)
  Top 0.406: 55.03,42.42 68.3,42.42 69.13,41.59 T2.3 | 55.03,42.42 52.94,42.42 52.5,41.98 52.5,39.48 51.83,38.81 v48.45,38.81 | 55.03,42.42 49.65,47.8
  Top 1.016: T5.3 32.55,28.75 v32.7,28.89
  Bottom 0.305: 48.45,34.4
  Bottom 0.406: v32.7,28.89 34.56,27.03 41.08,27.03 48.45,34.4 | v48.45,38.81 48.45,34.4
  other vias: 32.7,26.04
  pour Bottom: 32.07,29.53 34.61,29.53 35.24,28.89 40.96,28.89 43.81,31.75 43.81,38.1 45.4,39.68 49.85,39.68 49.85,37.78 49.7,27.8 47.78,25.88 arc45 47.59,25.43 47.59,25.42 32.07,25.42
  pour Top (no thermals): 32.07,29.53 33.66,29.53 33.66,25.4 32.07,25.4
  pour Top (isolate 0.254, no thermals): 70.8,41.13 53.31,41.13 53.31,38.2 53.28,32.72 53.19,32.72 47.72,38.2 47.72,43.08 49.41,43.08 49.44,43.04 51.71,43.04 51.71,44.82 49.35,47.18 49.35,50.16 53.67,50.16 53.8,50.29 53.8,57.34 66.36,57.3 66.36,47.94 70.8,43.5
N$49  (via drill 0.35)
  Top 0.152: R9.2 47.62,20.18 47.62,19.68 | 47.62,19.68 46.99,19.05 IC1.8 | R16.1 42.41,22.59 R12.2 v43.81,23.5 | v47.94,19.37 47.62,19.68
  Bottom 0.152: v43.81,23.5 v47.94,19.37
N$60
  Top 0.152: R44.2 R45.1 36.93,32.25 C25.1 36.83,32.67 35.39,34.11 IC5.2
SH_AC+
  Top 0.152: R6.1 46.29,8.18 48.82,8.18 49.53,8.89 49.53,22.54 47.62,24.45 45.72,24.45 43.81,26.35 43.81,26.99 | 43.81,26.99 RS1.1 48.46,26.99 48.61,27.14 48.61,28.74 47.89,29.46 44.99,29.46 40.47,33.99 IC5.6 | 43.81,26.99 43.81,28.26 42.55,29.53 39.05,29.53 38.1,30.48 R45.2 36.93,31.25 C25.2
  pour Top (rank 2, no thermals): 41.59,36.51 42.23,36.51 42.23,33.34 45.4,33.34 49.53,29.21 49.53,26.99 47.94,25.4 47.31,25.4 47.31,28.89 44.13,28.89 41.59,31.43
SH_AC-
  Top 0.152: R47.2 35.46,31.25 C26.2 35.56,30.25 35.93,29.87 37.48,29.87 38.46,28.89 42.55,28.89 43.18,28.26 43.18,26.99 | R4.1 48.9,8.89 48.9,22.54 47.62,23.81 45.72,23.81 43.18,26.35 43.18,26.99 | 43.18,26.99 RS1.2 T4.3
  pour Top (no thermals): 38.73,27.94 38.73,26.67 40.01,25.4 40.96,25.4 40.96,28.57 39.37,28.57
SH_DC+  (via drill 0.35)  (1 unrouted)
  Top 0.15: C28.2 30.49,48.26 v30.8,47.94
  Top 0.152: v73.02,34.45 73.02,33.09 | R41.1 24.63,47.81 v24.77,47.94 | R36.2 29.71,48.16 C28.2
  Top 1.016: R52.1 67.56,35.18
  Bottom 0.15: 43.78,46.08 66.96,46.08
  Bottom 0.152: v73.02,34.45 71.89,35.57 71.89,43.32 69.14,46.08 66.96,46.08 | v30.8,47.94 v24.77,47.94 | 30.83,47.94 v30.8,47.94 | v30.8,47.94 32.66,46.08 43.78,46.08
  pour Top (isolate 0.254): 64.55,37.29 71.49,37.29 arc-45 71.52,37.28 71.52,32.37 arc-45 71.5,32.31 74.58,32.31 74.58,37.24 arc45 74.57,37.27 81,37.29 81,31.1 64.65,31.1
SH_DC-  (via drill 0.35)
  Top 0.152: RS2.2 73,38.66 v73,37.21 | R39.1 21.09,47.33 22.66,48.9 v24.77,48.9 25.43,48.9 C29.2 26.17,48.16 R38.2
  Top 1.016: RS2.2 73.08,38.73 75.44,38.73 76.35,39.65 T1.3
  Bottom 0.152: v73,37.21 73.67,37.88 73.67,43.28 70.17,46.79 33.6,46.79 31.49,48.89 v24.77,48.89 v24.77,48.9
  pour Top (isolate 0.254, rank 2, no thermals): 91.44,37.7 74.55,37.6 74.55,39.41 71.59,39.41 71.56,39.39 71.56,37.57 71.55,37.56 55.31,37.56 55.24,37.49 55.24,40.64 75.03,40.64 75.03,43.81 91.44,43.81
VAC_RST  (via drill 0.35)
  Top 0.15: 33.46,14.92 33.49,14.92 34.62,13.8 IC4.7
  Top 0.152: v19.37,14.29 20.18,15.1 33.29,15.1 33.46,14.92
  Bottom 0.152: v19.37,14.29 19.37,13.65 18.41,12.7 10.79,12.7 7.62,15.88 7.62,19.81 3.3,24.13 U1.P$9
VREF  (via drill 0.35)
  Top 0.152: C6.1 28.57,30.45 28.57,29.84 27.93,29.2 IC6.5 27.94,28.88 v27.94,27.94 | v9.53,27.94 v9.53,15.88
  Bottom 0.152: v27.94,27.94 v9.53,27.94 | v9.53,15.88 11.43,13.97 U1.P$28
VREF/2  (via drill 0.35)
  Top 0.152: v20.95,30.48 C7.1 24.77,30.45 24.77,29.84 25.41,29.2 IC6.1 24.45,28.89 v24.13,29.21 | R17.2 43.18,22.09 v43.18,22.54 | R22.1 v29.84,8.89 | v11.43,40.64 v11.43,30.48 v11.43,17.78 v11.43,11.43 | R24.1 27.12,21.91 v27.94,21.91 | v45.09,11.09 45.59,10.59 R7.1 | R44.1 v39.37,30.48 | IC4.1 36.93,19.05 v37.47,19.05 | R42.1 23.63,45.03 v23.5,44.89 | R35.1 30.16,45.27 v30.16,44.77 | IC4.5 32.28,12.06 v31.11,12.06
  Bottom 0.152: v11.43,40.64 16.45,45.66 19.3,45.66 20.07,44.89 v23.5,44.89 30.04,44.89 v30.16,44.77 | v11.43,11.43 11.43,11.25 12.37,10.31 29.36,10.31 29.84,10.79 | 29.84,10.79 v31.11,12.06 32.38,13.34 42.55,13.34 44.79,11.09 v45.09,11.09 | v29.84,8.89 29.84,10.79 | v11.43,30.48 v20.95,30.48 | v37.47,19.05 37.47,20.32 | v24.13,29.21 24.45,28.89 28.89,28.89 31.75,31.75 38.09,31.75 v39.37,30.48 | v11.43,17.78 11.6,17.95 18.91,17.95 19.68,18.73 19.68,21.91 20.64,22.86 27.94,22.86 | 37.47,20.32 34.92,22.86 27.94,22.86 | 37.47,20.32 40.96,20.32 v43.18,22.54 | v27.94,21.91 27.94,22.86

### Text on the board
tNames: NUCLEO-F303K8 | J1 | -9V | GND | +9V | Strip Gauge | 10 | 7 | A | K | 5 | X1 | K | A | J2 | K | A | IMPEDANCE MEASUREMENT BOARD V4.2 | EXTERNAL POWER | TOKYO UNIVERCITY OF SCIENCE | 0
tValues: W 91mm H 55mm